# Altium schematic sheet PSU_LM317_9V0.SchDoc: PSU LM317 9V0
size A4; Organization: Altium Limited.; Address1: Level 3, 12a Rodborough Rd; Address2: Frenchs Forest 2086; Address3: NSW; Address4: AUSTRALIA; Revision: 6; SheetNumber: 34; SheetTotal: 64
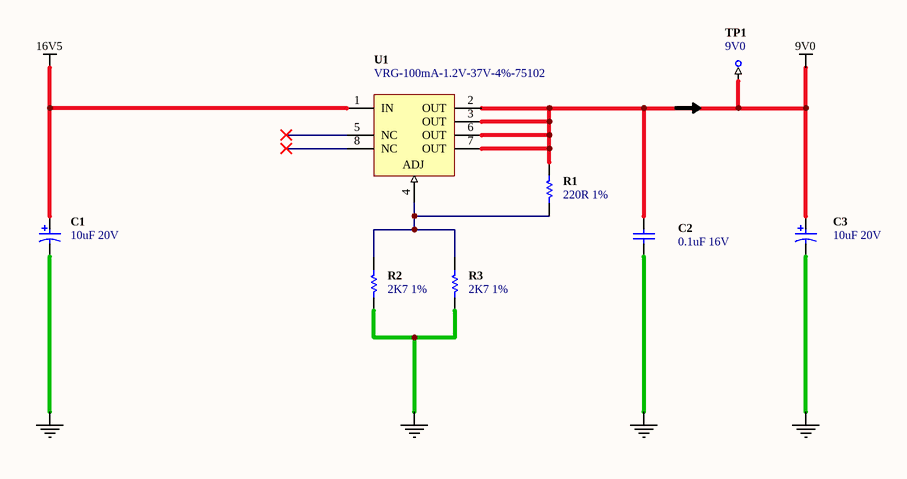
[diagram p0: PSU_LM317_9V0.SchDoc]

## Parts
C1  10uF 20V  [CAPC3528-STAR]
C2  0.1uF 16V  [CAPC1005-STAR]
C3  10uF 20V  [CAPC3528-STAR]
R1  220R 1%  [RESC1005-STAR]
R2  2K7 1%  [RESC1005-STAR]
R3  2K7 1%  [RESC1005-STAR]
TP1  9V0  [TestPin]  (no BOM)
U1  VRG-100mA-1.2V-37V-4%-75102  [SOP127P600-8]

## Nets
9V0: C2.1 C3.1 R1.2 TP1.1 U1.2(OUT) U1.3(OUT) U1.6(OUT) U1.7(OUT)
16V5: C1.1 U1.1(IN)
GND: C1.2 C2.2 C3.2 R2.1 R3.1
NetR1_1: R1.1 R2.2 R3.2 U1.4(ADJ)

Not connected (* = marked no-connect by the designer): U1 5(NC)* 8(NC)*

## Notes on the sheet
- Sheet Title
- Project Title
- Size:
- Date:
- A4
- Assy:
- Time:
- Sheet
- Revision:
- of
- File:

## Library data of the parts
C1 C3 = D-101-0007: Capacitor, Tantalum, 10uF 10% 20V MCCT-B (3528); Polarity: Polarized; Category: Capacitor; Capacitance: 10 uF; Mounting Technology: Surface Mount; Rated Voltage: 20 V; Status: Production; Technology: Tantalum; Tolerance: 10 %
C2 = D-101-0080: Capacitor, Ceramic, 0.1uF 10% 16V 0402 (1005) X7R; Polarity: Non-Polarized; Category: Capacitor; Capacitance: 0.1 uF; Dielectric: X7R; Mounting Technology: Surface Mount; Rated Voltage: 16 V; Status: Production; Technology: Ceramic; Tolerance: 10 %
R1 = D-100-0115: Resistor, 220R 1% 0402 (1005); Power Rating: 63 mW; Category: Resistor; Status: Production; Mounting Technology: Surface Mount; Resistance: 220 R; Tolerance: 1 %
R2 R3 = D-100-0105: Resistor, 2K7 1% 0402 (1005); Power Rating: 63 mW; Resistance: 2.7 K; Category: Resistor; Mounting Technology: Surface Mount; Status: Production; Tolerance: 1 %
TP1 = D-006-0000: Test Point, PCB Mount with Silkscreen Box; Category: Test-Point; Status: Production
U1 = D-204-0000: LM317LDR2, 3-Terminal Adjustable Regulator; Category: IC-Power; Status: Production